# Altium schematic sheet IO.SchDoc: Digital input and output
size A4; Date: Not used; ApprovedBy: Not used; CheckedBy: Not used; Author: Not used; CompanyName: STMicroelectronics; DrawnBy: Not used; Engineer: Not used; Organization: Not used; Address1: Not used; Address2: Not used; Address3: Not used; Address4: Not used; DocumentNumber: 6; Revision: Not used; SheetNumber: 6; SheetTotal: 9; Time: Not used; ImagePath: Not used; Application_BuildNumber: Not used
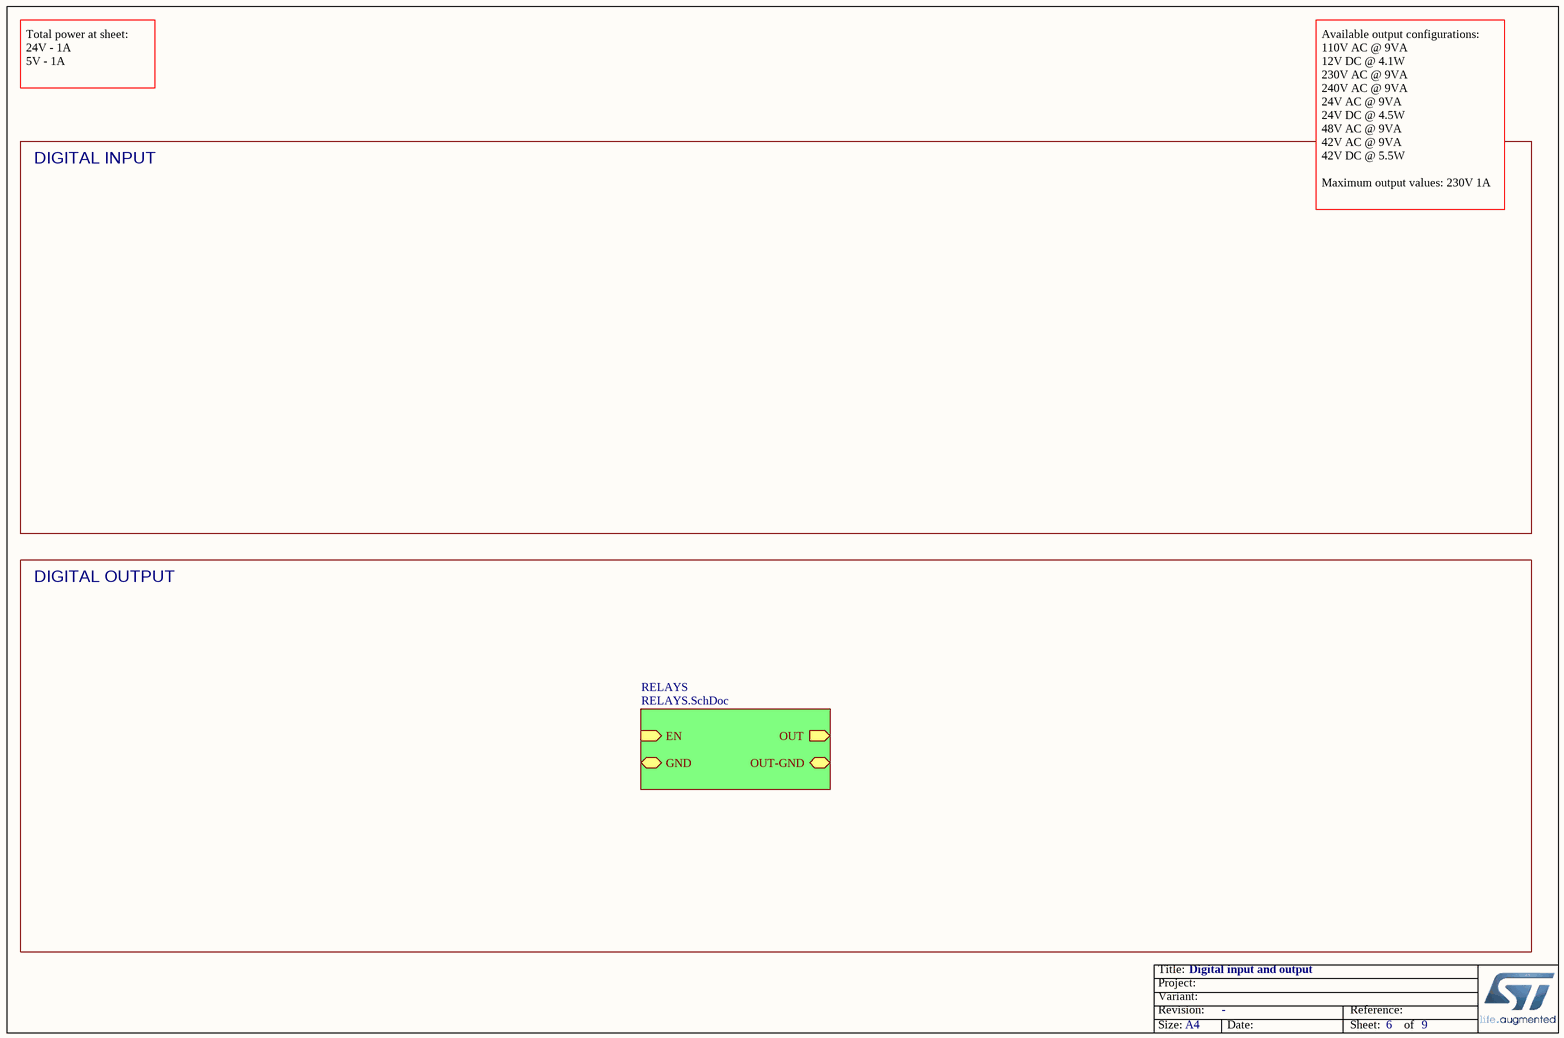
[diagram p0: IO.SchDoc]

## Sub-sheets
RELAYS = RELAYS.SchDoc: OUT (out), OUT-GND (bidir), EN (in), GND (bidir)

## Notes on the sheet
- Total power at sheet:
  24V - 1A
  5V - 1A
- DIGITAL INPUT
- Available output configurations:
  110V AC @ 9VA
  12V DC @ 4.1W
  230V AC @ 9VA
  240V AC @ 9VA
  24V AC @ 9VA
  24V DC @ 4.5W
  48V AC @ 9VA
  42V AC @ 9VA
  42V DC @ 5.5W
  Maximum output values: 230V 1A
- DIGITAL OUTPUT
- Title:
- Project:
- Size:
- Revision:
- Variant:
- A4
- -
- Date:
- Reference:
- Sheet:
- of